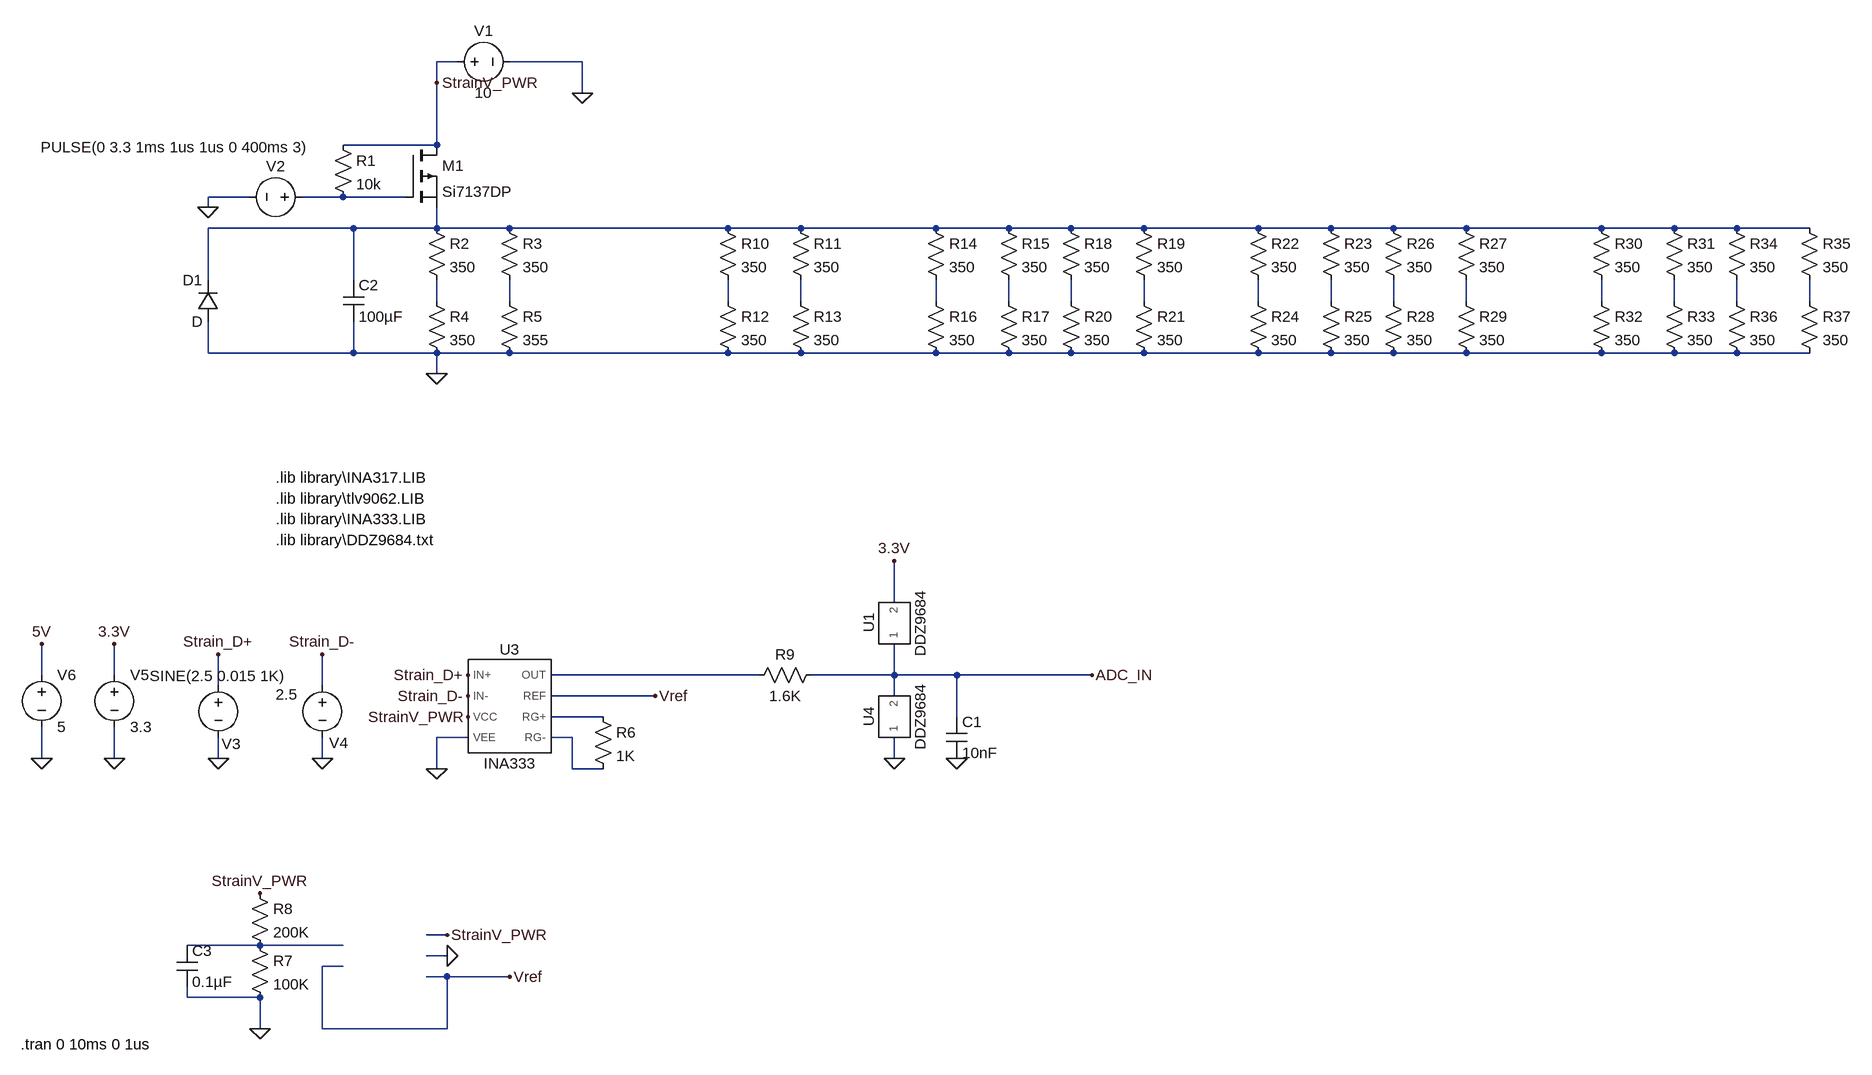
[diagram p0: schematic strainGaugeTransientAnalysis.asc]
strainGaugeTransientAnalysis.asc, the LTspice schematic file:
Version 4
SHEET 1 2180 1712
WIRE 32 16 0 16
WIRE 224 16 112 16
WIRE 0 48 0 16
WIRE 224 64 224 16
WIRE 0 144 0 48
WIRE 0 144 -144 144
WIRE -288 224 -352 224
WIRE -144 224 -208 224
WIRE -48 224 -144 224
WIRE -352 240 -352 224
WIRE -128 272 -352 272
WIRE 0 272 0 240
WIRE 0 272 -128 272
WIRE 112 272 0 272
WIRE 448 272 112 272
WIRE 560 272 448 272
WIRE 768 272 560 272
WIRE 880 272 768 272
WIRE 976 272 880 272
WIRE 1088 272 976 272
WIRE 1264 272 1088 272
WIRE 1376 272 1264 272
WIRE 1472 272 1376 272
WIRE 1584 272 1472 272
WIRE 1792 272 1584 272
WIRE 1904 272 1792 272
WIRE 2000 272 1904 272
WIRE 2112 272 2000 272
WIRE -352 352 -352 272
WIRE -128 352 -128 272
WIRE 0 384 0 352
WIRE 112 384 112 352
WIRE 448 384 448 352
WIRE 560 384 560 352
WIRE 768 384 768 352
WIRE 880 384 880 352
WIRE 976 384 976 352
WIRE 1088 384 1088 352
WIRE 1264 384 1264 352
WIRE 1376 384 1376 352
WIRE 1472 384 1472 352
WIRE 1584 384 1584 352
WIRE 1792 384 1792 352
WIRE 1904 384 1904 352
WIRE 2000 384 2000 352
WIRE 2112 384 2112 352
WIRE -352 464 -352 416
WIRE -128 464 -128 416
WIRE -128 464 -352 464
WIRE 0 464 -128 464
WIRE 112 464 0 464
WIRE 448 464 112 464
WIRE 560 464 448 464
WIRE 768 464 560 464
WIRE 880 464 768 464
WIRE 976 464 880 464
WIRE 1088 464 976 464
WIRE 1264 464 1088 464
WIRE 1376 464 1264 464
WIRE 1472 464 1376 464
WIRE 1584 464 1472 464
WIRE 1792 464 1584 464
WIRE 1904 464 1792 464
WIRE 2000 464 1904 464
WIRE 2112 464 2000 464
WIRE 0 496 0 464
WIRE 704 848 704 784
WIRE -608 960 -608 912
WIRE -496 960 -496 912
WIRE 496 960 176 960
WIRE 704 960 704 912
WIRE 704 960 576 960
WIRE 800 960 704 960
WIRE 1008 960 800 960
WIRE -336 976 -336 928
WIRE -176 976 -176 928
WIRE 336 992 176 992
WIRE 704 992 704 960
WIRE 256 1024 176 1024
WIRE 800 1024 800 960
WIRE 48 1056 0 1056
WIRE 208 1056 176 1056
WIRE -608 1088 -608 1040
WIRE -496 1088 -496 1040
WIRE -336 1088 -336 1056
WIRE -176 1088 -176 1056
WIRE 704 1088 704 1056
WIRE 0 1104 0 1056
WIRE 208 1104 208 1056
WIRE 256 1104 208 1104
WIRE 16 1360 -16 1360
WIRE -272 1376 -384 1376
WIRE -144 1376 -272 1376
WIRE 16 1392 -16 1392
WIRE -144 1408 -176 1408
WIRE 16 1424 -16 1424
WIRE 112 1424 16 1424
WIRE -384 1456 -384 1440
WIRE -272 1456 -384 1456
WIRE -272 1504 -272 1456
WIRE -176 1504 -176 1408
WIRE 16 1504 16 1424
WIRE 16 1504 -176 1504
FLAG 224 64 0
FLAG -352 240 0
FLAG 0 496 0
FLAG -336 928 Strain_D+
FLAG -176 928 Strain_D-
FLAG 48 960 Strain_D+
FLAG 48 992 Strain_D-
FLAG -272 1504 0
FLAG 0 48 StrainV_PWR
FLAG -272 1296 StrainV_PWR
FLAG 48 1024 StrainV_PWR
FLAG 0 1104 0
FLAG -336 1088 0
FLAG -176 1088 0
FLAG 1008 960 ADC_IN
FLAG 800 1088 0
FLAG 16 1360 StrainV_PWR
FLAG 16 1392 0
FLAG 336 992 Vref
FLAG 112 1424 Vref
FLAG -496 1088 0
FLAG -496 912 3.3V
FLAG -608 1088 0
FLAG -608 912 5V
FLAG 704 1088 0
FLAG 704 784 3.3V
SYMBOL voltage 16 16 R270
WINDOW 0 32 56 VTop 2
WINDOW 3 -32 56 VBottom 2
WINDOW 123 0 0 Left 0
WINDOW 39 0 0 Left 0
SYMATTR InstName V1
SYMATTR Value 10
SYMBOL pmos -48 144 R0
SYMATTR InstName M1
SYMATTR Value Si7137DP
SYMBOL res -160 128 R0
SYMATTR InstName R1
SYMATTR Value 10k
SYMBOL voltage -192 224 R90
WINDOW 0 -32 56 VBottom 2
WINDOW 3 -92 211 VTop 2
WINDOW 123 0 0 Left 0
WINDOW 39 0 0 Left 0
SYMATTR InstName V2
SYMATTR Value PULSE(0 3.3 1ms 1us 1us 0 400ms 3)
SYMBOL res -16 256 R0
SYMATTR InstName R2
SYMATTR Value 350
SYMBOL res 96 256 R0
SYMATTR InstName R3
SYMATTR Value 350
SYMBOL res -16 368 R0
SYMATTR InstName R4
SYMATTR Value 350
SYMBOL res -288 1360 R0
SYMATTR InstName R7
SYMATTR Value 100K
SYMBOL voltage -336 960 R0
WINDOW 0 20 90 Top 2
WINDOW 3 -1 17 Bottom 2
WINDOW 123 0 0 Left 0
WINDOW 39 0 0 Left 0
SYMATTR InstName V3
SYMATTR Value SINE(2.5 0.015 1K)
SYMBOL voltage -176 960 R0
WINDOW 0 25 89 Top 2
WINDOW 3 -55 45 Bottom 2
WINDOW 123 0 0 Left 0
WINDOW 39 0 0 Left 0
SYMATTR InstName V4
SYMATTR Value 2.5
SYMBOL res 592 944 R90
WINDOW 0 0 56 VBottom 2
WINDOW 3 32 56 VTop 2
SYMATTR InstName R9
SYMATTR Value 1.6K
SYMBOL cap 784 1024 R0
SYMATTR InstName C1
SYMATTR Value 10nF
SYMBOL res -288 1280 R0
SYMATTR InstName R8
SYMATTR Value 200K
SYMBOL cap -144 352 R0
SYMATTR InstName C2
SYMATTR Value 100µF
SYMBOL cap -400 1376 R0
SYMATTR InstName C3
SYMATTR Value 0.1µF
SYMBOL res 432 256 R0
SYMATTR InstName R10
SYMATTR Value 350
SYMBOL res 544 256 R0
SYMATTR InstName R11
SYMATTR Value 350
SYMBOL res 432 368 R0
SYMATTR InstName R12
SYMATTR Value 350
SYMBOL res 544 368 R0
SYMATTR InstName R13
SYMATTR Value 350
SYMBOL res 752 256 R0
SYMATTR InstName R14
SYMATTR Value 350
SYMBOL res 864 256 R0
SYMATTR InstName R15
SYMATTR Value 350
SYMBOL res 752 368 R0
SYMATTR InstName R16
SYMATTR Value 350
SYMBOL res 864 368 R0
SYMATTR InstName R17
SYMATTR Value 350
SYMBOL res 960 256 R0
SYMATTR InstName R18
SYMATTR Value 350
SYMBOL res 1072 256 R0
SYMATTR InstName R19
SYMATTR Value 350
SYMBOL res 960 368 R0
SYMATTR InstName R20
SYMATTR Value 350
SYMBOL res 1072 368 R0
SYMATTR InstName R21
SYMATTR Value 350
SYMBOL res 1248 256 R0
SYMATTR InstName R22
SYMATTR Value 350
SYMBOL res 1360 256 R0
SYMATTR InstName R23
SYMATTR Value 350
SYMBOL res 1248 368 R0
SYMATTR InstName R24
SYMATTR Value 350
SYMBOL res 1360 368 R0
SYMATTR InstName R25
SYMATTR Value 350
SYMBOL res 1456 256 R0
SYMATTR InstName R26
SYMATTR Value 350
SYMBOL res 1568 256 R0
SYMATTR InstName R27
SYMATTR Value 350
SYMBOL res 1456 368 R0
SYMATTR InstName R28
SYMATTR Value 350
SYMBOL res 1568 368 R0
SYMATTR InstName R29
SYMATTR Value 350
SYMBOL res 1776 256 R0
SYMATTR InstName R30
SYMATTR Value 350
SYMBOL res 1888 256 R0
SYMATTR InstName R31
SYMATTR Value 350
SYMBOL res 1776 368 R0
SYMATTR InstName R32
SYMATTR Value 350
SYMBOL res 1888 368 R0
SYMATTR InstName R33
SYMATTR Value 350
SYMBOL res 1984 256 R0
SYMATTR InstName R34
SYMATTR Value 350
SYMBOL res 2096 256 R0
SYMATTR InstName R35
SYMATTR Value 350
SYMBOL res 1984 368 R0
SYMATTR InstName R36
SYMATTR Value 350
SYMBOL res 2096 368 R0
SYMATTR InstName R37
SYMATTR Value 350
SYMBOL res 240 1008 R0
SYMATTR InstName R6
SYMATTR Value 1K
SYMBOL diode -336 416 R180
WINDOW 0 24 64 Left 2
WINDOW 3 24 0 Left 2
SYMATTR InstName D1
SYMBOL voltage -496 944 R0
WINDOW 123 0 0 Left 0
WINDOW 39 0 0 Left 0
SYMATTR InstName V5
SYMATTR Value 3.3
SYMBOL voltage -608 944 R0
WINDOW 123 0 0 Left 0
WINDOW 39 0 0 Left 0
SYMATTR InstName V6
SYMATTR Value 5
SYMBOL DDZ9684 704 880 R270
SYMATTR InstName U1
SYMBOL DDZ9684 704 1024 R270
SYMATTR InstName U4
SYMBOL INA333 112 1008 R0
SYMATTR InstName U3
SYMBOL res 96 368 R0
SYMATTR InstName R5
SYMATTR Value 355
TEXT -248 656 Left 2 !.lib library\\INA317.LIB
TEXT -248 688 Left 2 !.lib library\\tlv9062.LIB
TEXT -248 720 Left 2 !.lib library\\INA333.LIB
TEXT -248 752 Left 2 !.lib library\\DDZ9684.txt
TEXT -640 1528 Left 2 !.tran 0 10ms 0 1us

The netlist it stands for:
* strainGaugeTransientAnalysis.asc
V1 StrainV_PWR 0 10
M1 StrainV_PWR N001 N002 N002 Si7137DP
R1 StrainV_PWR N001 10k
V2 N001 0 PULSE(0 3.3 1ms 1us 1us 0 400ms 3)
R2 N002 N003 350
R3 N002 N004 350
R4 N003 0 350
R7 N022 0 100K
V3 Strain_D+ 0 SINE(2.5 0.015 1K)
V4 Strain_D- 0 2.5
R9 ADC_IN N019 1.6K
C1 ADC_IN 0 10nF
R8 StrainV_PWR N022 200K
C2 N002 0 100µF
C3 N022 0 0.1µF
R10 N002 N005 350
R11 N002 N006 350
R12 N005 0 350
R13 N006 0 350
R14 N002 N007 350
R15 N002 N008 350
R16 N007 0 350
R17 N008 0 350
R18 N002 N009 350
R19 N002 N010 350
R20 N009 0 350
R21 N010 0 350
R22 N002 N011 350
R23 N002 N012 350
R24 N011 0 350
R25 N012 0 350
R26 N002 N013 350
R27 N002 N014 350
R28 N013 0 350
R29 N014 0 350
R30 N002 N015 350
R31 N002 N016 350
R32 N015 0 350
R33 N016 0 350
R34 N002 N017 350
R35 N002 N018 350
R36 N017 0 350
R37 N018 0 350
R6 N020 N021 1K
D1 0 N002 D
V5 3.3V 0 3.3
V6 5V 0 5
XU1 ADC_IN 3.3V DDZ9684  ; pins 1 2
XU4 0 ADC_IN DDZ9684  ; pins 1 2
XU3 Strain_D+ Strain_D- StrainV_PWR 0 N019 Vref N020 N021 INA333  ; pins IN+ IN- VCC VEE OUT REF RG+ RG-
R5 N004 0 355
.model D D
.lib standard.dio
.model NMOS NMOS
.model PMOS PMOS
.lib standard.mos
.lib library\INA317.LIB
.lib library\tlv9062.LIB
.lib library\INA333.LIB
.lib library\DDZ9684.txt
.tran 0 10ms 0 1us
.lib C:\Users\Parry\Documents\GitHub\BCIT-BAJA\testing\LTSPICE_SIMS\library\DDZ9684.txt
.lib C:\Users\Parry\Documents\GitHub\BCIT-BAJA\testing\LTSPICE_SIMS\library\INA333.LIB
.backanno
.end